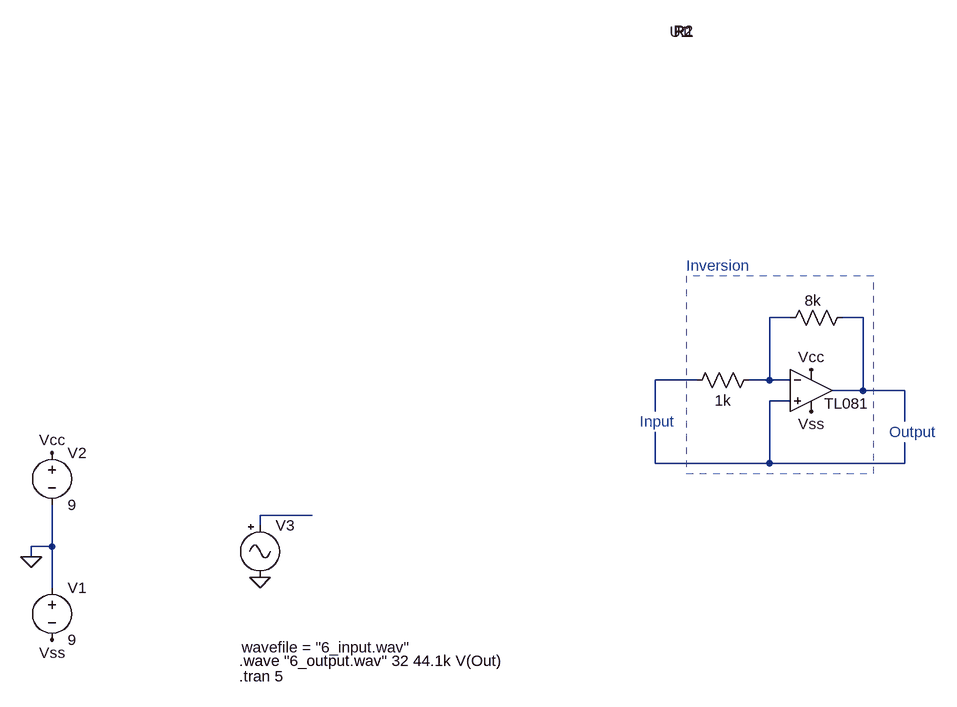
[diagram p0: schematic 6_Inverter.asc]
6_Inverter.asc, the LTspice schematic file:
Version 4
SHEET 1 1372 680
WIRE 1136 -176 1104 -176
WIRE 1248 -176 1216 -176
WIRE 992 -80 928 -80
WIRE 1104 -80 1104 -176
WIRE 1104 -80 1072 -80
WIRE 1136 -80 1104 -80
WIRE 1248 -64 1248 -176
WIRE 1248 -64 1200 -64
WIRE 1312 -64 1248 -64
WIRE 1136 -48 1104 -48
WIRE 928 -32 928 -80
WIRE 1312 -16 1312 -64
WIRE 928 48 928 0
WIRE 1104 48 1104 -48
WIRE 1104 48 928 48
WIRE 1312 48 1312 16
WIRE 1312 48 1104 48
WIRE 400 128 320 128
WIRE 320 144 320 128
WIRE 0 176 0 112
WIRE 0 176 -32 176
WIRE -32 192 -32 176
WIRE 0 240 0 176
FLAG -32 192 0
FLAG 0 32 Vcc
FLAG 0 320 Vss
FLAG 320 224 0
FLAG 1168 -96 Vcc
FLAG 1168 -32 Vss
SYMBOL voltage 0 224 R0
WINDOW 123 0 0 Left 0
WINDOW 39 0 0 Left 0
SYMATTR InstName V1
SYMATTR Value 9
SYMBOL voltage 0 16 R0
WINDOW 123 0 0 Left 0
WINDOW 39 0 0 Left 0
SYMATTR InstName V2
SYMATTR Value 9
SYMBOL Misc\\signal 320 128 R0
WINDOW 3 -28 203 Left 2
SYMATTR Value wavefile = "6_input.wav"
SYMATTR InstName V3
SYMBOL AutoGenerated\\TL081 1168 -128 R0
WINDOW 0 -218 -488 Left 2
WINDOW 3 20 84 Left 2
SYMATTR InstName U1
SYMBOL res 1088 -96 R90
WINDOW 0 -505 115 VBottom 2
WINDOW 3 32 56 VTop 2
SYMATTR InstName R1
SYMATTR Value 1k
SYMBOL res 1232 -192 R90
WINDOW 0 -410 260 VBottom 2
WINDOW 3 -26 61 VTop 2
SYMATTR InstName R2
SYMATTR Value 8k
TEXT 288 376 Left 2 !.tran 5
TEXT 288 352 Left 2 !.wave "6_output.wav" 32 44.1k V(Out)
TEXT 976 -256 Left 2 ;Inversion
TEXT 1288 0 Left 2 ;Output
TEXT 904 -16 Left 2 ;Input
RECTANGLE Normal 976 64 1264 -240 2

The netlist it stands for:
* 6_Inverter.asc
V1 0 Vss 9
V2 Vcc 0 9
V3 N005 0 wavefile = "6_input.wav"
* U1: TL081 (symbol AutoGenerated\TL081 not available, pins judged from their places): In+=N004 In-=N001 V+=Vcc V-=Vss OUT=N002
R1 N001 N003 1k
R2 N002 N001 8k
.tran 5
.wave "6_output.wav" 32 44.1k V(Out)
* Inversion
* Output
* Input
.backanno
.end